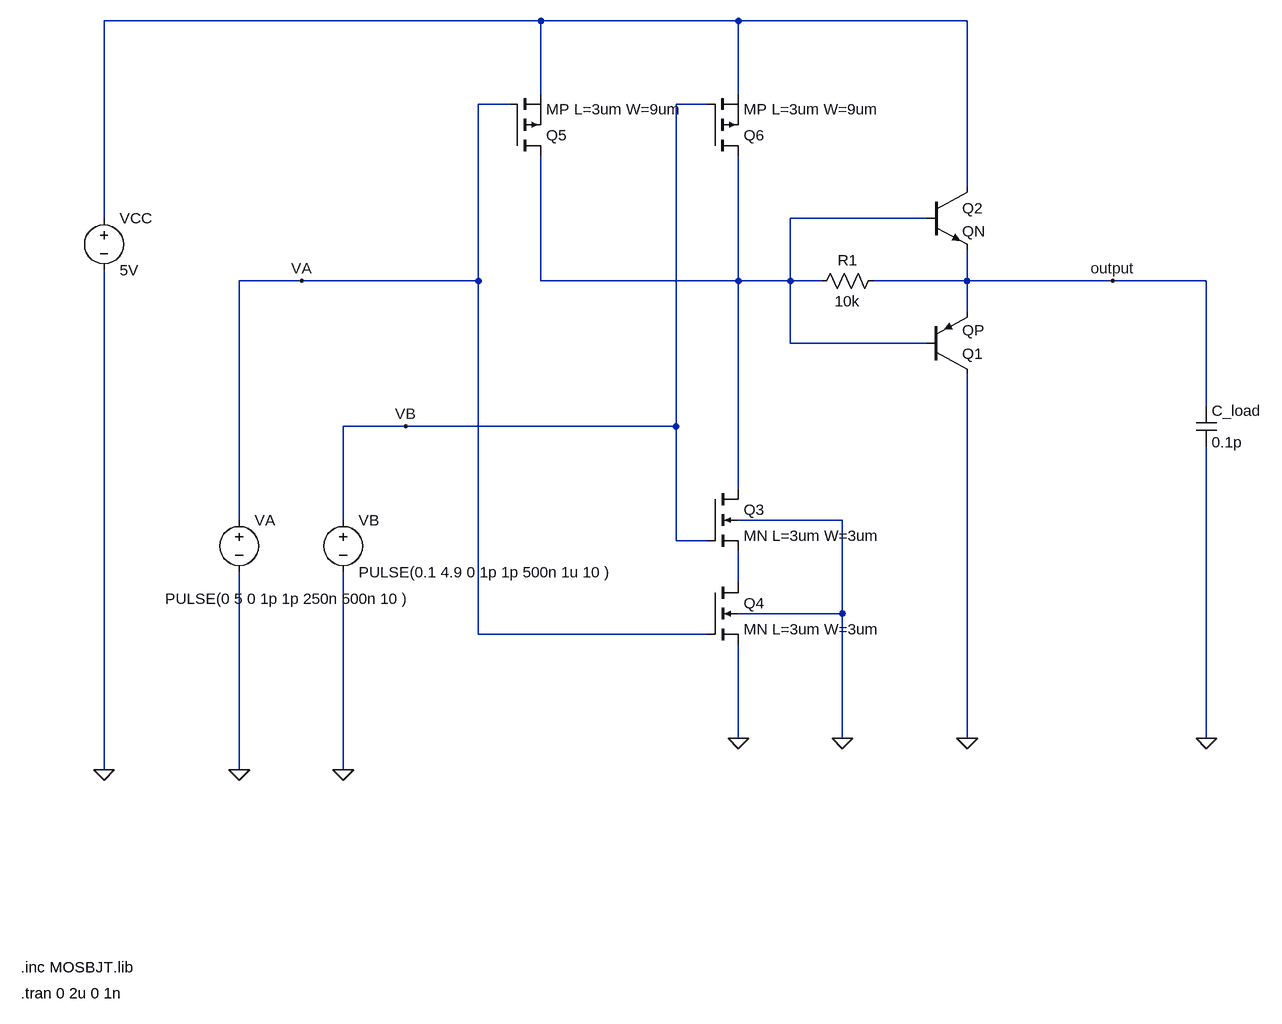
[diagram p0: schematic BICMOS-0.asc]
BICMOS-0.asc, the LTspice schematic file:
Version 4
SHEET 1 1324 1208
WIRE 208 -304 -464 -304
WIRE 512 -304 208 -304
WIRE 864 -304 512 -304
WIRE 208 -192 208 -304
WIRE 512 -192 512 -304
WIRE 160 -176 112 -176
WIRE 464 -176 416 -176
WIRE 864 -48 864 -304
WIRE -464 0 -464 -304
WIRE 800 0 592 0
WIRE -160 96 -256 96
WIRE 112 96 112 -176
WIRE 112 96 -160 96
WIRE 208 96 208 -96
WIRE 512 96 512 -96
WIRE 512 96 208 96
WIRE 592 96 592 0
WIRE 592 96 512 96
WIRE 640 96 592 96
WIRE 864 96 864 48
WIRE 864 96 720 96
WIRE 1088 96 864 96
WIRE 1232 96 1088 96
WIRE 864 144 864 96
WIRE 592 192 592 96
WIRE 800 192 592 192
WIRE 1232 288 1232 96
WIRE 0 320 -96 320
WIRE 416 320 416 -176
WIRE 416 320 0 320
WIRE 512 416 512 96
WIRE -256 464 -256 96
WIRE -96 464 -96 320
WIRE 672 464 512 464
WIRE 416 496 416 320
WIRE 464 496 416 496
WIRE 512 560 512 512
WIRE 672 608 672 464
WIRE 672 608 512 608
WIRE 112 640 112 96
WIRE 464 640 112 640
WIRE 512 800 512 656
WIRE 672 800 672 608
WIRE 864 800 864 240
WIRE 1232 800 1232 352
WIRE -464 848 -464 80
WIRE -256 848 -256 544
WIRE -96 848 -96 544
FLAG 1232 800 0
FLAG 512 800 0
FLAG 672 800 0
FLAG -464 848 0
FLAG -256 848 0
FLAG -96 848 0
FLAG -160 96 VA
FLAG 0 320 VB
FLAG 1088 96 output
FLAG 864 800 0
SYMBOL voltage -464 -16 R0
SYMATTR InstName VCC
SYMATTR Value 5V
SYMBOL voltage -256 448 R0
WINDOW 3 -114 137 Left 2
WINDOW 123 0 0 Left 0
WINDOW 39 0 0 Left 0
SYMATTR Value PULSE(0 5 0 1p 1p 250n 500n 10 )
SYMATTR InstName VA
SYMBOL voltage -96 448 R0
WINDOW 123 0 0 Left 0
WINDOW 39 0 0 Left 0
SYMATTR InstName VB
SYMATTR Value PULSE(0.1 4.9 0 1p 1p 500n 1u 10 )
SYMBOL pmos 160 -96 M180
SYMATTR InstName Q5
SYMATTR Value MP L=3um W=9um
SYMBOL pmos 464 -96 M180
SYMATTR InstName Q6
SYMATTR Value MP L=3um W=9um
SYMBOL nmos4 464 416 R0
SYMATTR InstName Q3
SYMATTR Value MN L=3um W=3um
SYMBOL nmos4 464 560 R0
SYMATTR InstName Q4
SYMATTR Value MN L=3um W=3um
SYMBOL cap 1216 288 R0
SYMATTR InstName C_load
SYMATTR Value 0.1p
SYMBOL npn 800 -48 R0
SYMATTR InstName Q2
SYMATTR Value QN
SYMBOL pnp 800 240 M180
SYMATTR InstName Q1
SYMATTR Value QP
SYMBOL res 736 80 R90
WINDOW 0 0 56 VBottom 2
WINDOW 3 32 56 VTop 2
SYMATTR InstName R1
SYMATTR Value 10k
TEXT -592 1152 Left 2 !.inc MOSBJT.lib
TEXT -592 1192 Left 2 !.tran 0 2u 0 1n

The netlist it stands for:
* BICMOS-0.asc
VCC N001 0 5V
VA VA 0 PULSE(0 5 0 1p 1p 250n 500n 10 )
VB VB 0 PULSE(0.1 4.9 0 1p 1p 500n 1u 10 )
M§Q5 N002 VA N001 N001 MP L=3um W=9um
M§Q6 N002 VB N001 N001 MP L=3um W=9um
M§Q3 N002 VB N003 0 MN L=3um W=3um
M§Q4 N003 VA 0 0 MN L=3um W=3um
C_load output 0 0.1p
Q2 N001 N002 output 0 QN
Q1 0 N002 output 0 QP
R1 output N002 10k
.model NPN NPN
.model PNP PNP
.lib standard.bjt
.model NMOS NMOS
.model PMOS PMOS
.lib standard.mos
.inc MOSBJT.lib
.tran 0 2u 0 1n
.backanno
.end

* Results of the author's LTspice run, read from the files saved beside the schematic
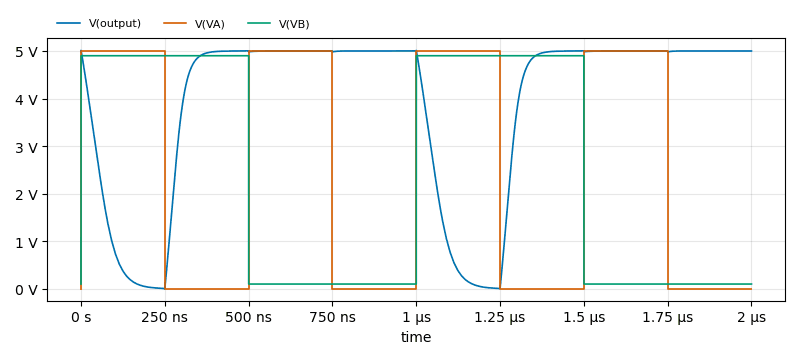
[diagram p1: Transient Analysis of BICMOS-0.asc, plotted from the saved traces]
* Transient Analysis, 1 run:
*   V(output): min 2.537 mV, max 5.013 V, average 3.87 V, rms 4.292 V, last 5 V
*   V(VA): min 0 V, max 5 V, average 2.5 V, rms 3.536 V, last 0 V
*   V(VB): min 100 mV, max 4.9 V, average 2.5 V, rms 3.466 V, last 100 mV